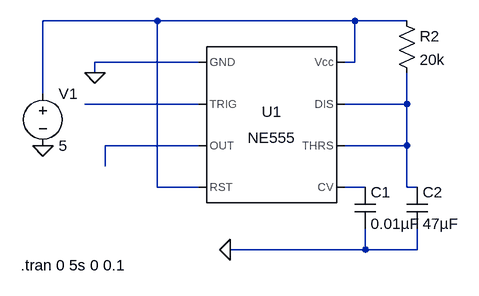
[diagram p0: schematic Draft5.asc]
Draft5.asc, the LTspice schematic file:
Version 4
SHEET 1 880 680
WIRE 16 16 -160 16
WIRE 320 16 16 16
WIRE 400 16 320 16
WIRE 80 80 -80 80
WIRE 320 80 320 16
WIRE 320 80 304 80
WIRE -80 96 -80 80
WIRE -160 128 -160 16
WIRE 80 144 -96 144
WIRE 400 144 400 96
WIRE 400 144 304 144
WIRE 80 208 -64 208
WIRE 400 208 400 144
WIRE 400 208 304 208
WIRE -64 240 -64 208
WIRE 16 272 16 16
WIRE 80 272 16 272
WIRE 336 272 304 272
WIRE 400 272 400 208
WIRE 416 272 400 272
WIRE 336 368 336 336
WIRE 336 368 128 368
WIRE 416 368 416 336
WIRE 416 368 336 368
FLAG -80 96 0
FLAG 128 368 0
FLAG -160 208 0
SYMBOL Misc\\NE555 192 176 R0
SYMATTR InstName U1
SYMBOL cap 320 272 R0
SYMATTR InstName C1
SYMATTR Value 0.01µF
SYMBOL voltage -160 112 R0
WINDOW 123 0 0 Left 0
WINDOW 39 0 0 Left 0
SYMATTR InstName V1
SYMATTR Value 5
SYMBOL res 384 0 R0
SYMATTR InstName R2
SYMATTR Value 20k
SYMBOL cap 400 272 R0
SYMATTR InstName C2
SYMATTR Value 47µF
TEXT -194 392 Left 2 !.tran 0 5s 0 0.1

The netlist it stands for:
* Draft5.asc
XU1 0 N002 N004 N001 N005 N003 N003 N001 NE555  ; pins GND TRIG OUT RST CV THRS DIS Vcc
C1 N005 0 0.01µF
V1 N001 0 5
R2 N001 N003 20k
C2 N003 0 47µF
.tran 0 5s 0 0.1
.lib NE555.sub
.backanno
.end